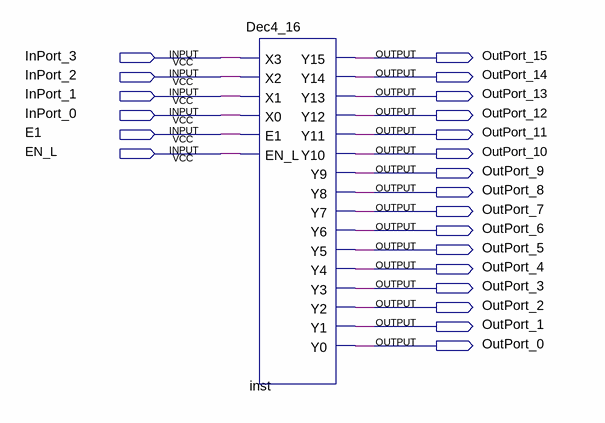
[diagram p0: schematic sheet]
// Quartus schematic DecoderDemo2.bdf as structural Verilog: 1 symbols, 22 pins
module DecoderDemo2 (
  input  InPort_3,
  input  InPort_2,
  input  InPort_1,
  input  InPort_0,
  input  E1,
  input  EN_L,
  output OutPort_15,
  output OutPort_14,
  output OutPort_13,
  output OutPort_12,
  output OutPort_11,
  output OutPort_10,
  output OutPort_9,
  output OutPort_8,
  output OutPort_7,
  output OutPort_6,
  output OutPort_5,
  output OutPort_4,
  output OutPort_3,
  output OutPort_2,
  output OutPort_1,
  output OutPort_0
);

  Dec4_16 inst (
    .X3(InPort_3), .X2(InPort_2), .X1(InPort_1), .X0(InPort_0), .E1(E1), .EN_L(EN_L), .Y15(OutPort_15),
    .Y14(OutPort_14), .Y13(OutPort_13), .Y12(OutPort_12), .Y11(OutPort_11), .Y10(OutPort_10), .Y9(OutPort_9),
    .Y8(OutPort_8), .Y7(OutPort_7), .Y6(OutPort_6), .Y5(OutPort_5), .Y4(OutPort_4), .Y3(OutPort_3),
    .Y2(OutPort_2), .Y1(OutPort_1), .Y0(OutPort_0));
endmodule
